# Altium schematic sheet ASBB_WheelSpeed.SchDoc
size A4
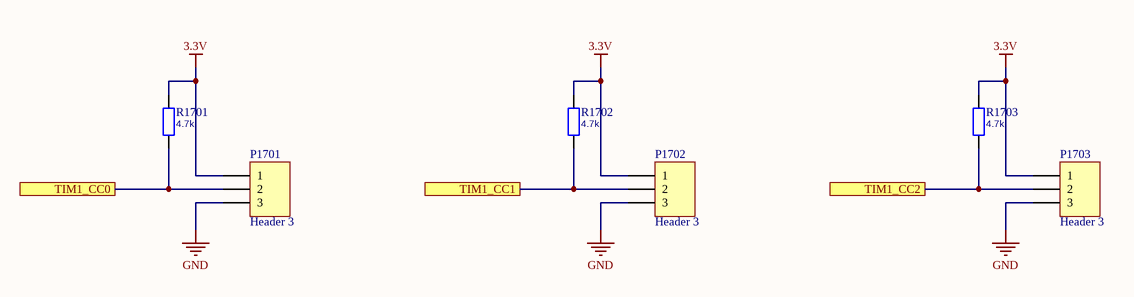
[diagram p0: ASBB_WheelSpeed.SchDoc]

## Parts
P1701  Header 3  [HDR1X3]
P1702  Header 3  [HDR1X3]
P1703  Header 3  [HDR1X3]
R1701  4.7k  [0603]
R1702  4.7k  [0603]
R1703  4.7k  [0603]

## Ports
TIM1_CC0, TIM1_CC1, TIM1_CC2

## Nets
3.3V: P1701.1 P1702.1 P1703.1 R1701.2 R1702.2 R1703.2
GND: P1701.3 P1702.3 P1703.3
TIM1_CC0: P1701.2 R1701.1 ; port TIM1_CC0
TIM1_CC1: P1702.2 R1702.1 ; port TIM1_CC1
TIM1_CC2: P1703.2 R1703.1 ; port TIM1_CC2

## Library data of the parts
P1701-P1703 = Header 3: Header, 3-Pin; LatestRevisionDate: 17-Jul-2002; LatestRevisionNote: Re-released for DXP Platform.; Publisher: Altium Limited
R1701-R1703 = Resistor: Partnumber: ?; Value: ?